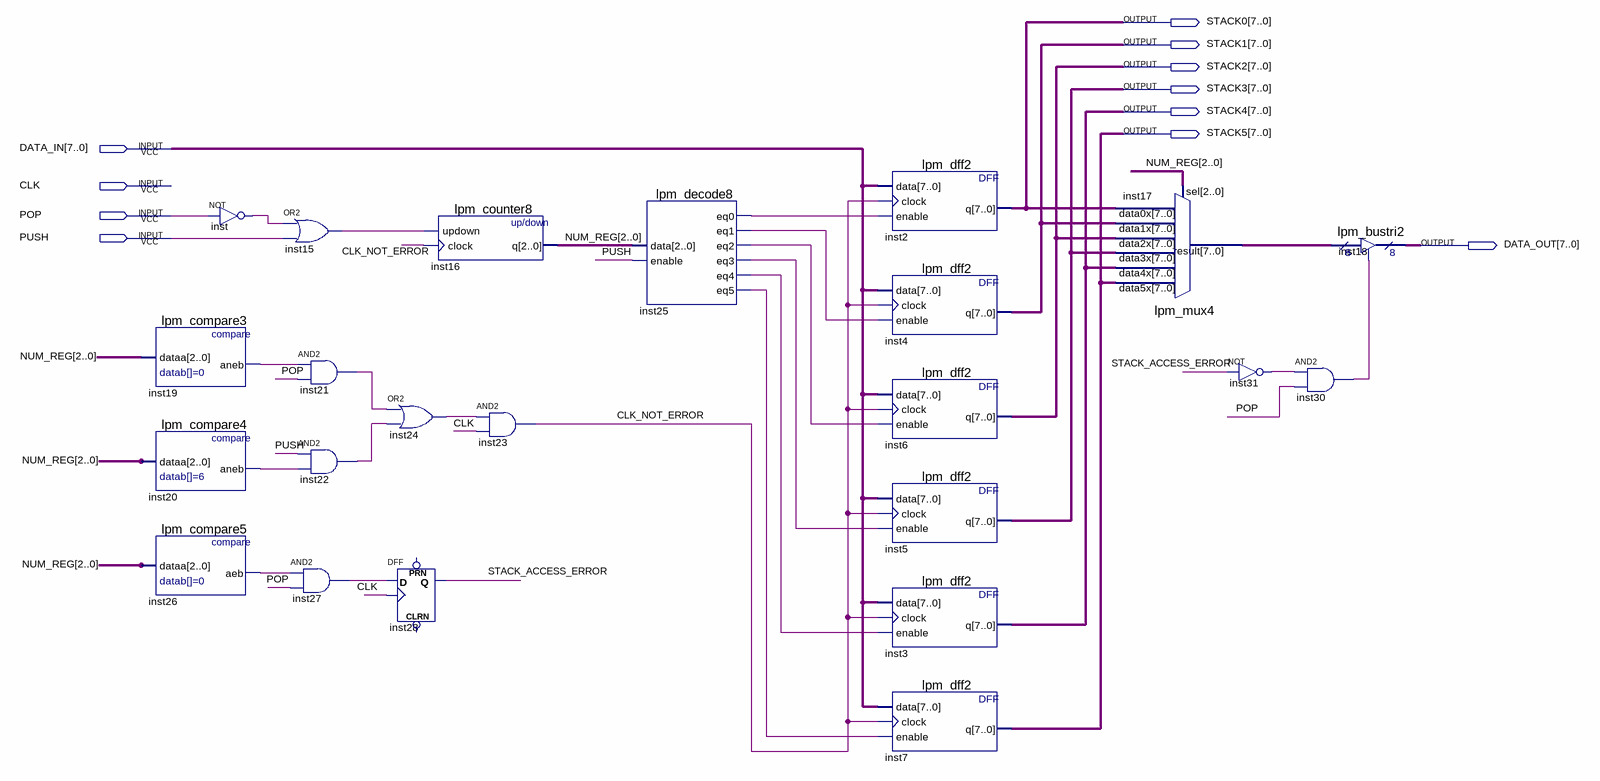
[diagram p0: schematic sheet]
// Quartus schematic STACK.bdf as structural Verilog: 23 symbols, 11 pins
module STACK (
  input  [7:0] DATA_IN,
  input  CLK,
  input  POP,
  input  PUSH,
  output [7:0] STACK0,
  output [7:0] STACK1,
  output [7:0] STACK2,
  output [7:0] STACK3,
  output [7:0] STACK4,
  output [7:0] STACK5,
  output [7:0] DATA_OUT
);

  wire CLK_NOT_ERROR, inst15_out, inst19_aneb, inst20_aneb, inst21_out, inst22_out, inst24_out, inst25_eq0,
       inst25_eq1, inst25_eq2, inst25_eq3, inst25_eq4, inst25_eq5, inst26_aeb, inst27_out, inst30_out,
       inst31_out, inst_out, STACK_ACCESS_ERROR;
  wire [2:0] NUM_REG;
  wire [7:0] inst17_result;

  lpm_compare3 inst19 (.dataa(NUM_REG), .aneb(inst19_aneb));
  lpm_compare4 inst20 (.dataa(NUM_REG), .aneb(inst20_aneb));
  lpm_compare5 inst26 (.dataa(NUM_REG), .aeb(inst26_aeb));
  not inst (inst_out, POP);
  or inst15 (inst15_out, inst_out, PUSH);
  and inst21 (inst21_out, inst19_aneb, POP);
  and inst22 (inst22_out, PUSH, inst20_aneb);
  and inst27 (inst27_out, inst26_aeb, POP);
  or inst24 (inst24_out, inst21_out, inst22_out);
  DFF inst28 (.CLK(CLK), .D(inst27_out), .Q(STACK_ACCESS_ERROR));  // open: CLRN, PRN
  lpm_counter8 inst16 (.updown(inst15_out), .clock(CLK_NOT_ERROR), .q(NUM_REG));
  and inst23 (CLK_NOT_ERROR, inst24_out, CLK);
  lpm_decode8 inst25 (
    .data(NUM_REG), .enable(PUSH), .eq0(inst25_eq0), .eq1(inst25_eq1), .eq2(inst25_eq2), .eq3(inst25_eq3),
    .eq4(inst25_eq4), .eq5(inst25_eq5));
  lpm_dff2 inst2 (.data(DATA_IN), .clock(CLK_NOT_ERROR), .enable(inst25_eq0), .q(STACK0));
  lpm_dff2 inst4 (.data(DATA_IN), .clock(CLK_NOT_ERROR), .enable(inst25_eq1), .q(STACK1));
  lpm_dff2 inst6 (.data(DATA_IN), .clock(CLK_NOT_ERROR), .enable(inst25_eq2), .q(STACK2));
  lpm_dff2 inst5 (.data(DATA_IN), .clock(CLK_NOT_ERROR), .enable(inst25_eq3), .q(STACK3));
  lpm_dff2 inst3 (.data(DATA_IN), .clock(CLK_NOT_ERROR), .enable(inst25_eq4), .q(STACK4));
  lpm_dff2 inst7 (.data(DATA_IN), .clock(CLK_NOT_ERROR), .enable(inst25_eq5), .q(STACK5));
  lpm_mux4 inst17 (
    .data5x(STACK5), .data4x(STACK4), .data3x(STACK3), .data2x(STACK2), .data1x(STACK1), .data0x(STACK0),
    .sel(NUM_REG), .result(inst17_result));
  not inst31 (inst31_out, STACK_ACCESS_ERROR);
  lpm_bustri2 inst18 (.enabledt(inst30_out), .data(inst17_result), .tridata(DATA_OUT));
  and inst30 (inst30_out, inst31_out, POP);
endmodule
